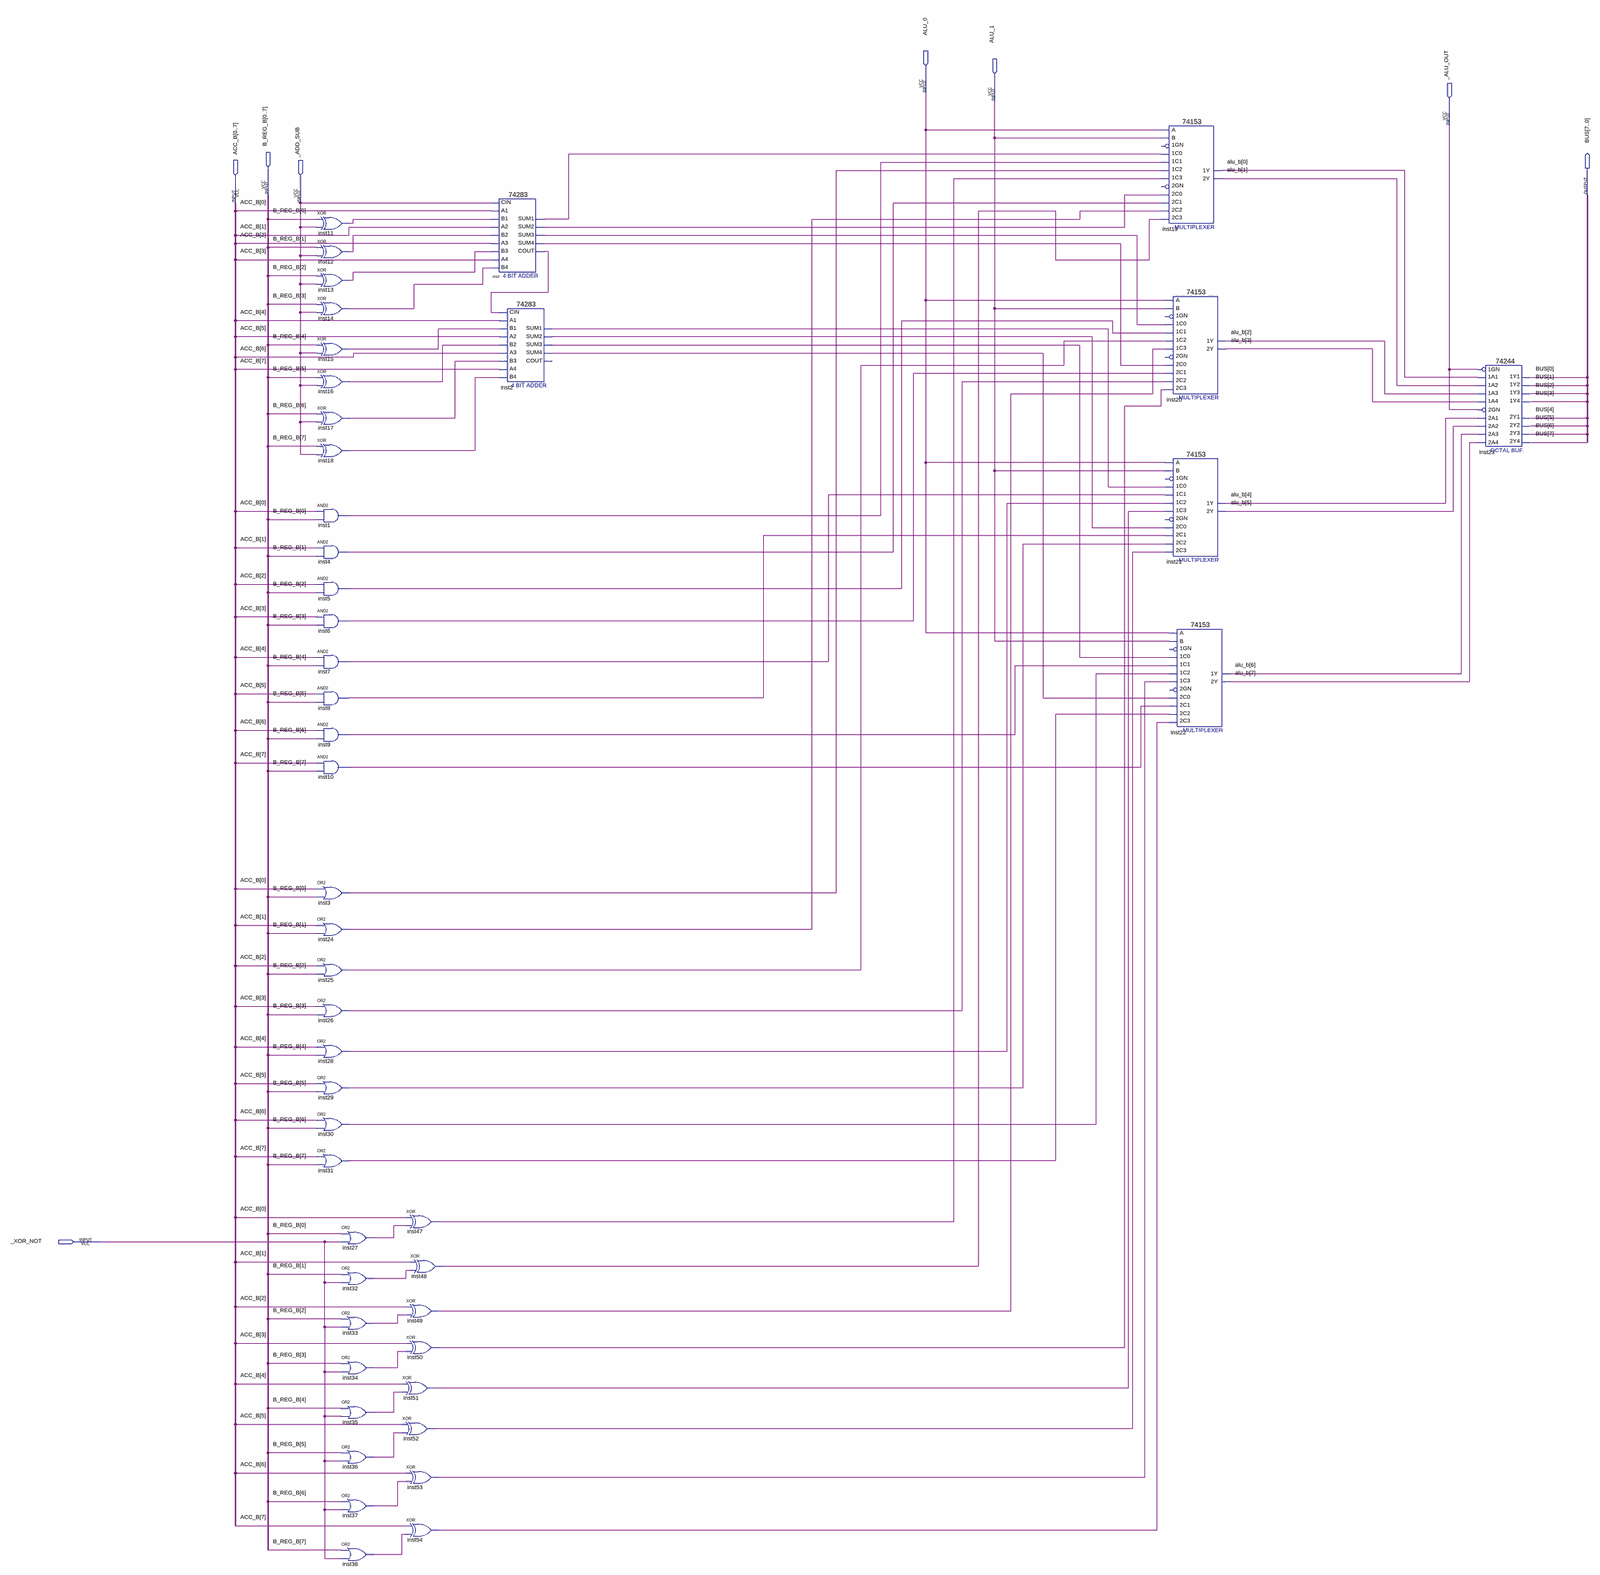
[diagram p0: schematic sheet, whole]
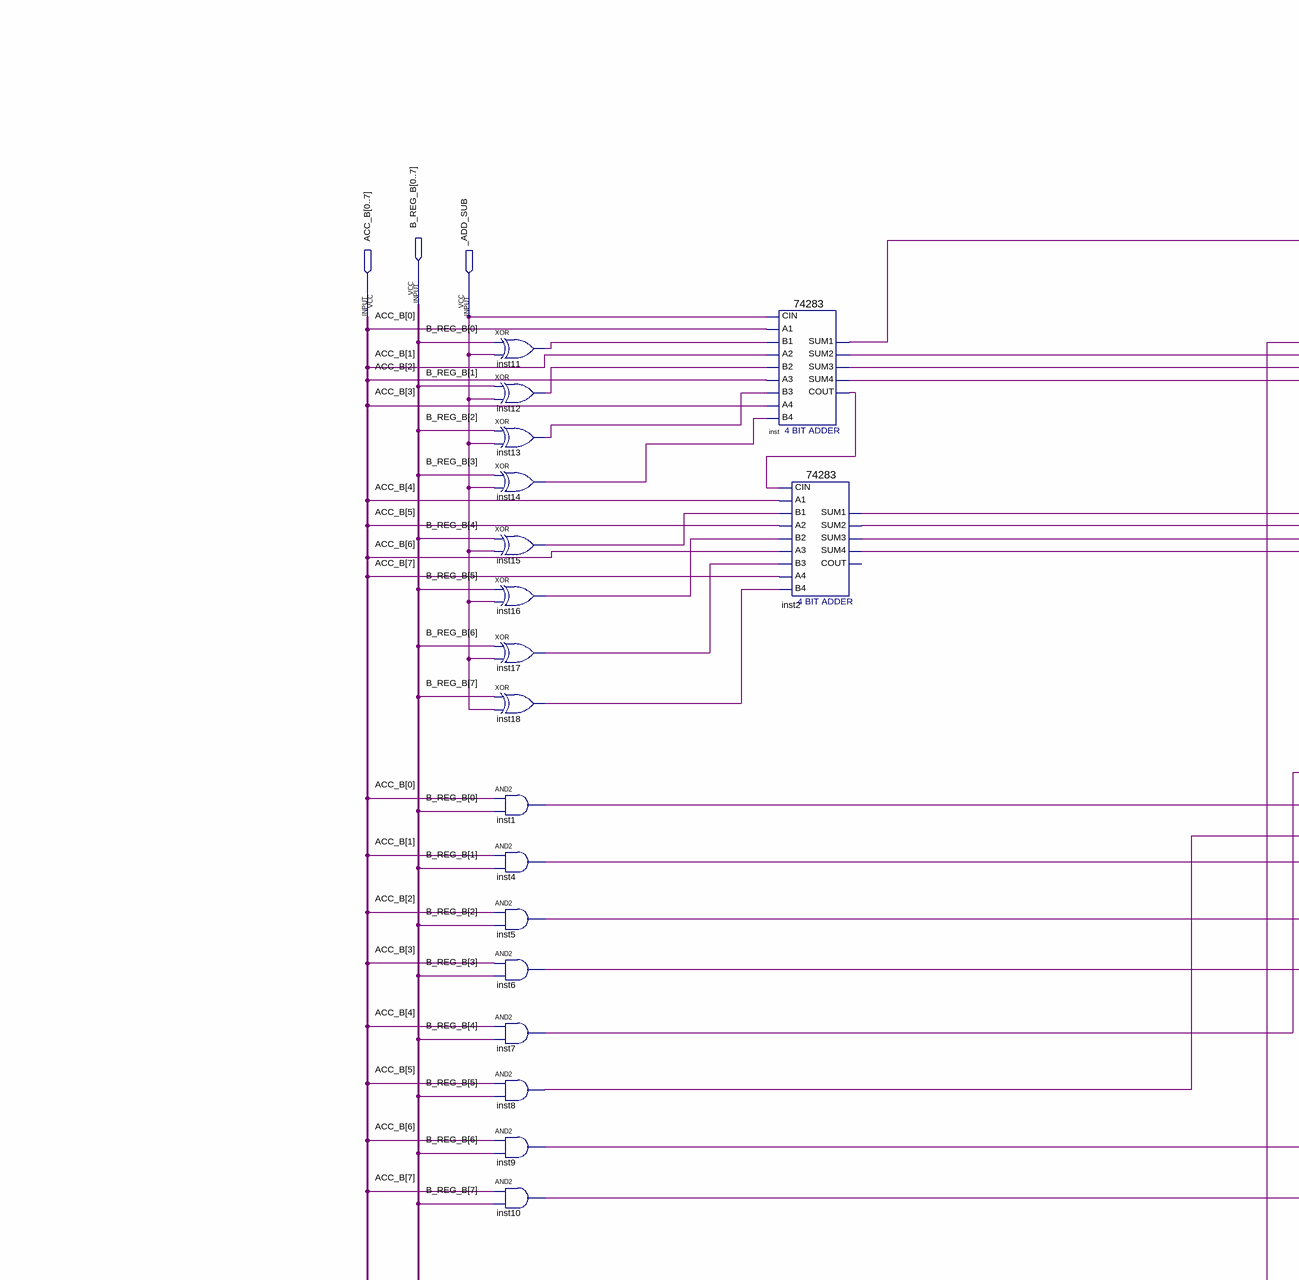
[diagram p1: schematic sheet, upper left part]
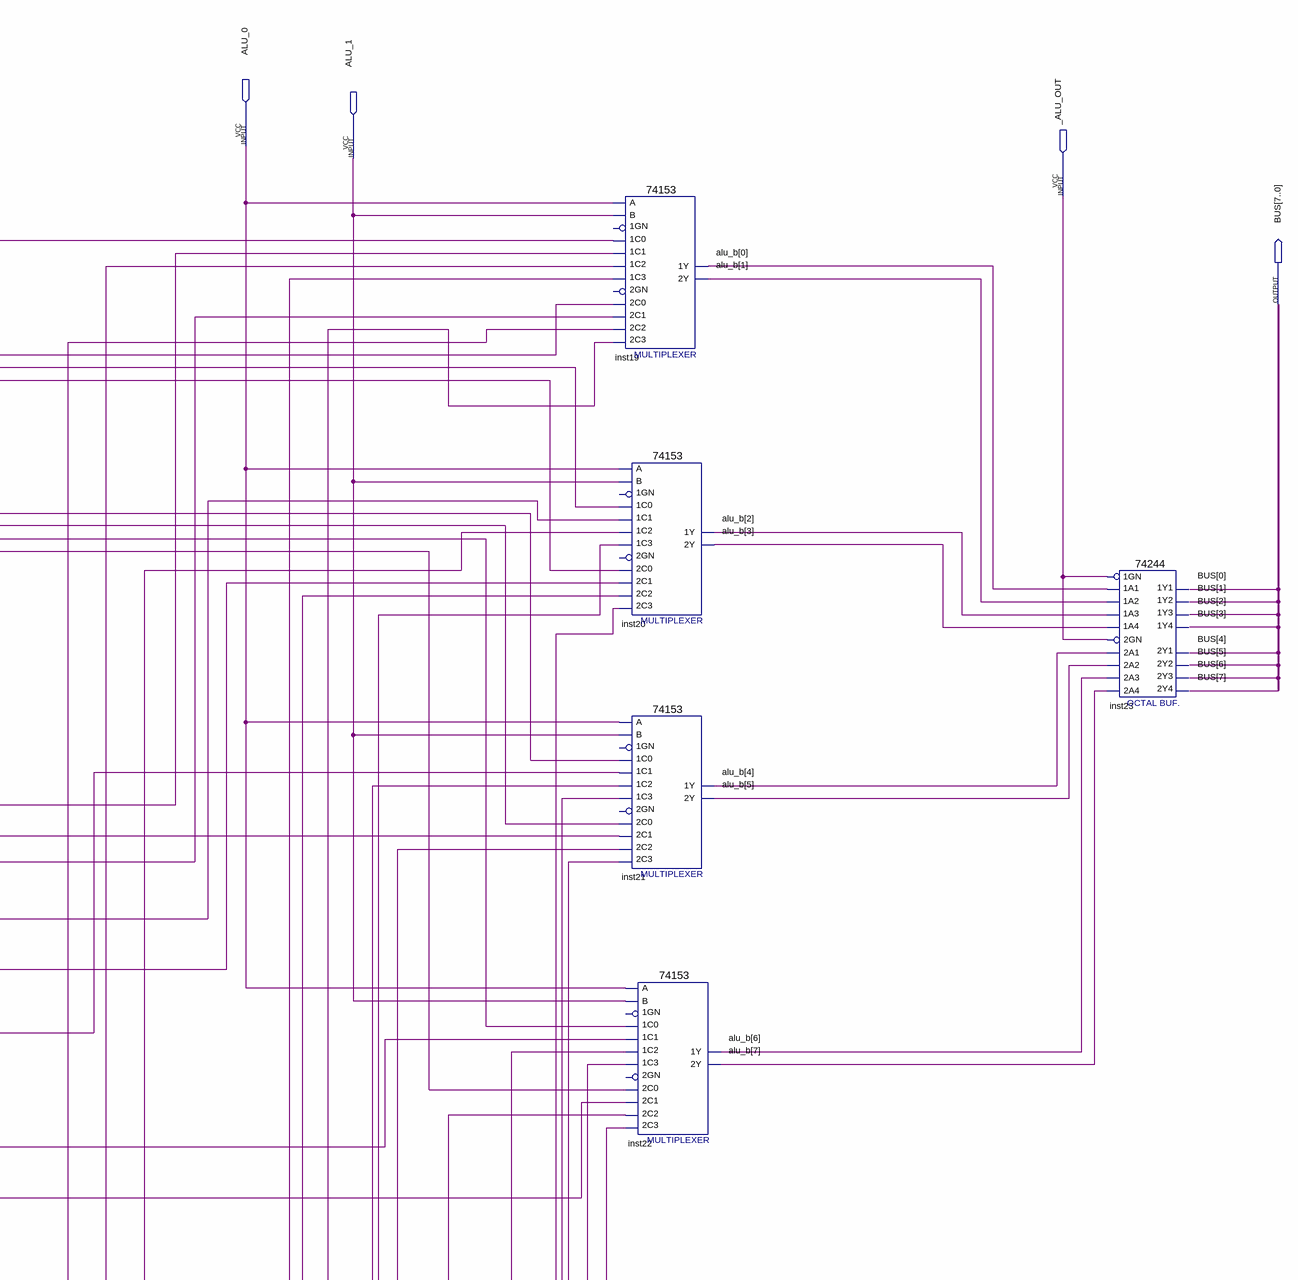
[diagram p2: schematic sheet, upper right part]
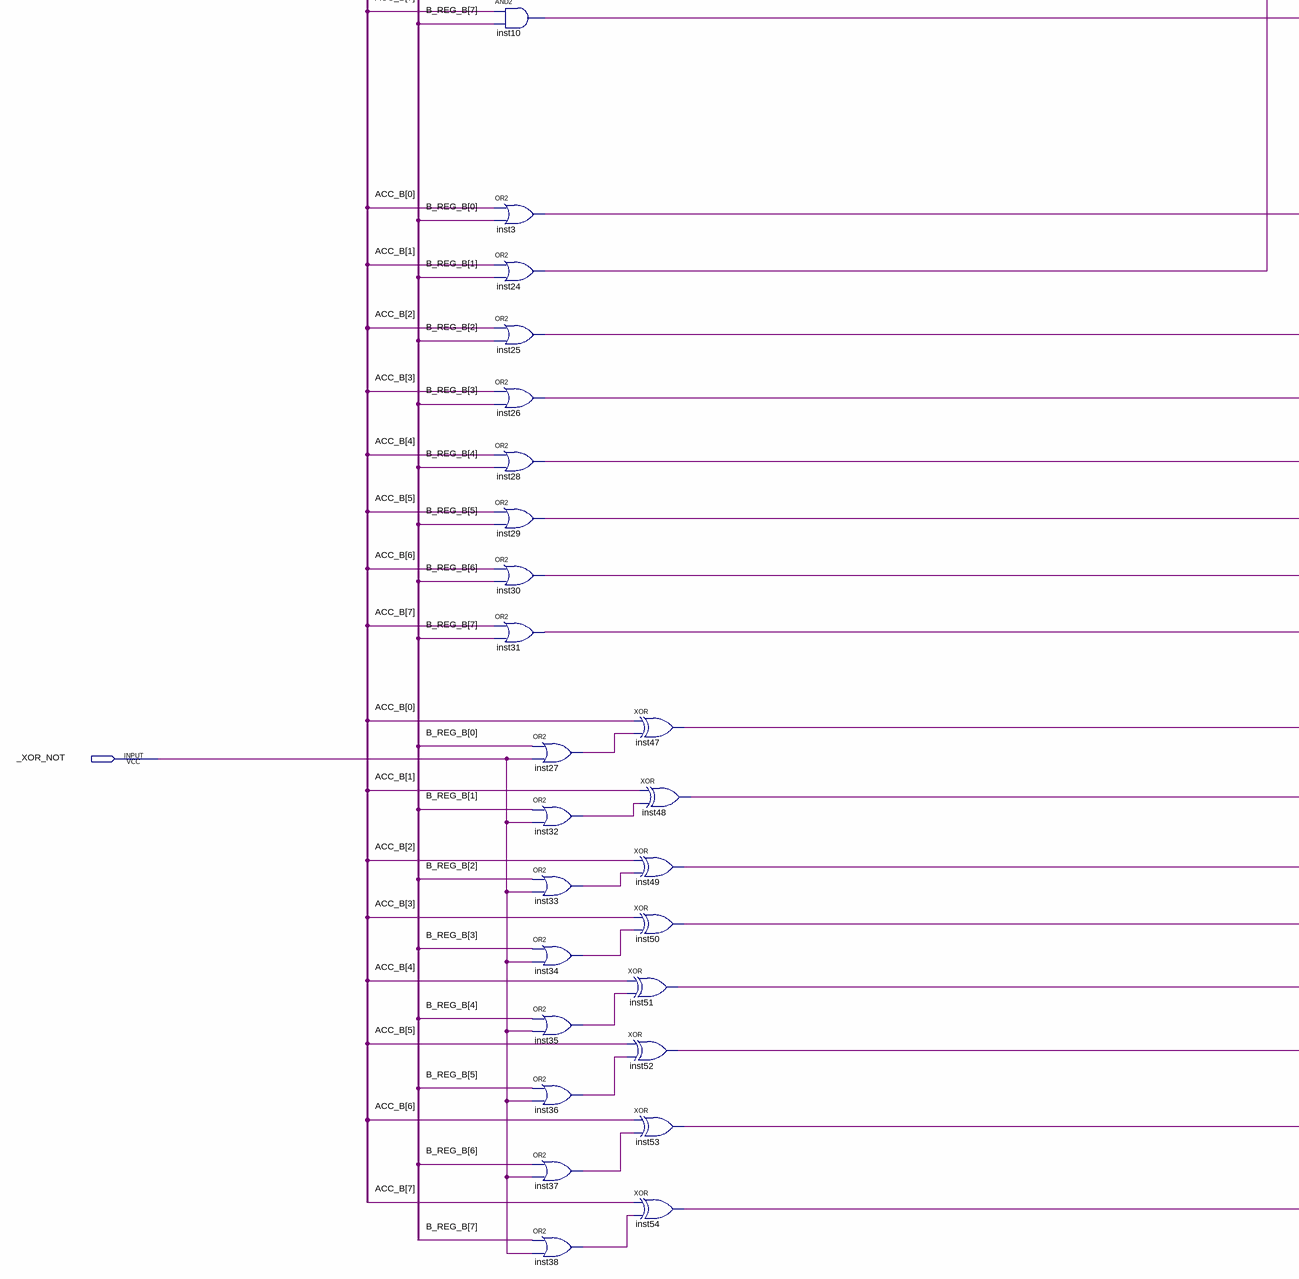
[diagram p3: schematic sheet, lower left part]
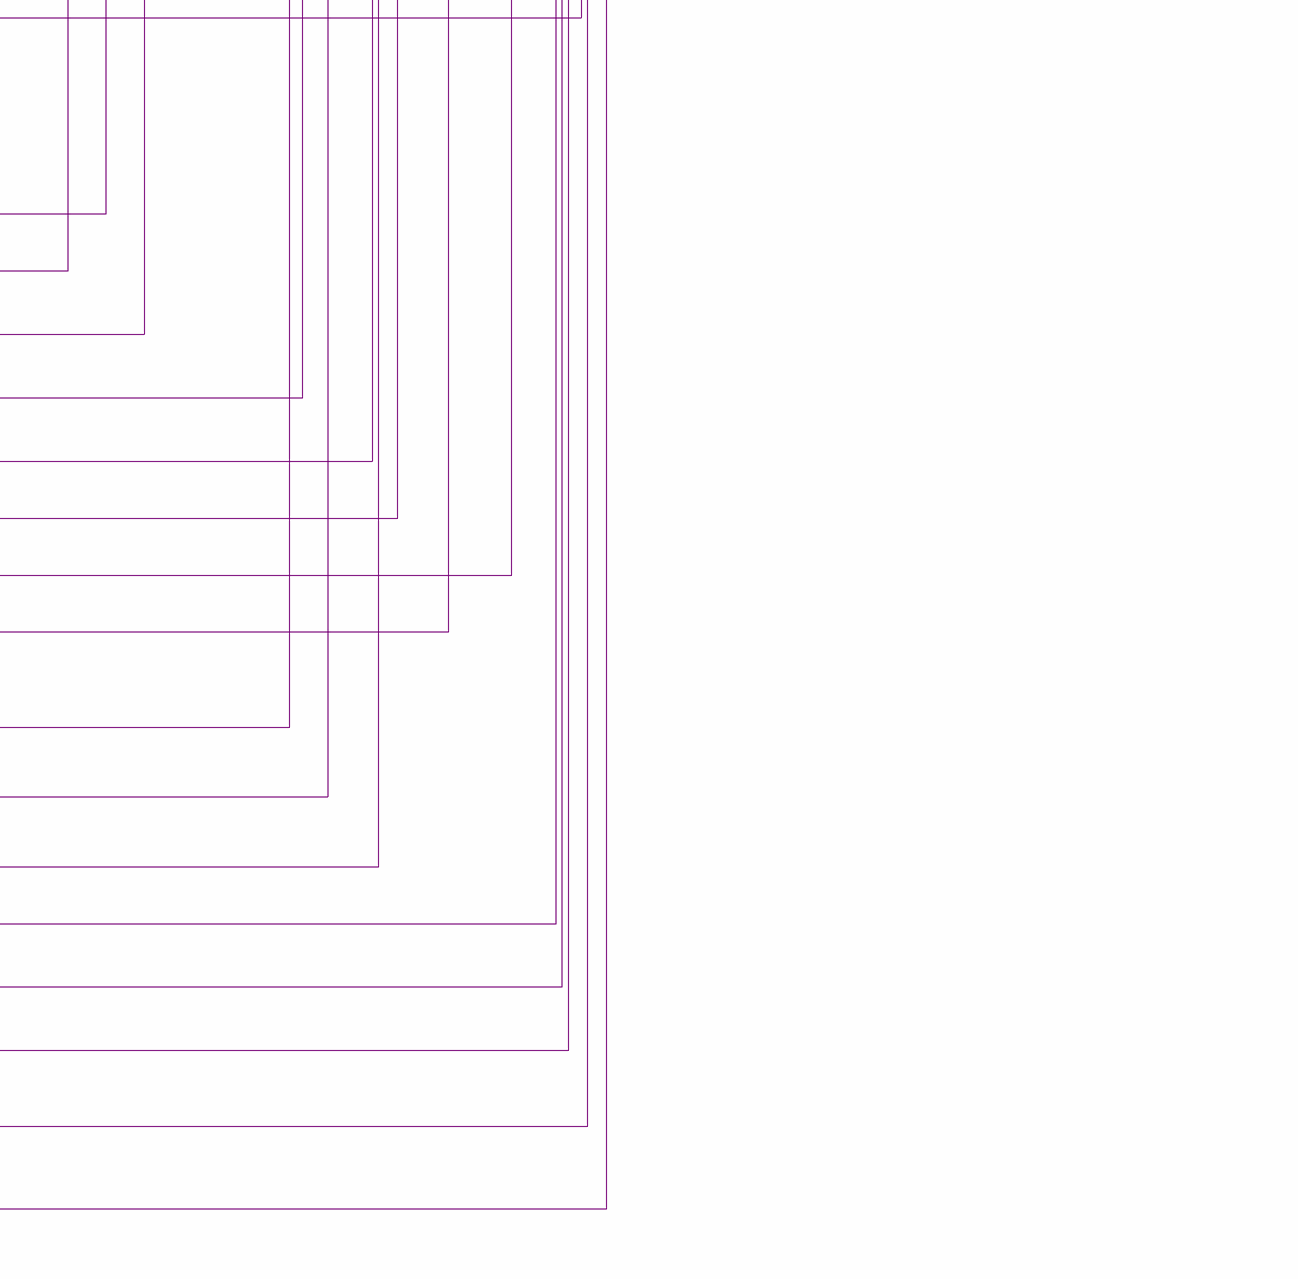
[diagram p4: schematic sheet, lower right part]
// Quartus schematic TrabalhoSistemas.bdf as structural Verilog: 47 symbols, 8 pins
module TrabalhoSistemas (
  input  ALU_0,
  input  ALU_1,
  input  _ALU_OUT,
  input  [0:7] B_REG_B,
  input  [0:7] ACC_B,
  input  _ADD_SUB,
  input  _XOR_NOT,
  output [7:0] BUS
);

  wire inst1_out, inst2_sum1, inst2_sum2, inst2_sum3, inst2_sum4, inst3_out, inst4_out, inst5_out, inst6_out,
       inst7_out, inst8_out, inst9_out, inst10_out, inst11_out, inst12_out, inst13_out, inst14_out,
       inst15_out, inst16_out, inst17_out, inst18_out, inst24_out, inst25_out, inst26_out, inst27_out,
       inst28_out, inst29_out, inst30_out, inst31_out, inst32_out, inst33_out, inst34_out, inst35_out,
       inst36_out, inst37_out, inst38_out, inst47_out, inst48_out, inst49_out, inst50_out, inst51_out,
       inst52_out, inst53_out, inst54_out, inst_cout, inst_sum1, inst_sum2, inst_sum3, inst_sum4;
  wire [7:0] alu_b;

  xor inst11 (inst11_out, B_REG_B[0], _ADD_SUB);
  xor inst12 (inst12_out, B_REG_B[1], _ADD_SUB);
  xor inst13 (inst13_out, B_REG_B[2], _ADD_SUB);
  xor inst14 (inst14_out, B_REG_B[3], _ADD_SUB);
  xor inst15 (inst15_out, B_REG_B[4], _ADD_SUB);
  xor inst16 (inst16_out, B_REG_B[5], _ADD_SUB);
  xor inst17 (inst17_out, B_REG_B[6], _ADD_SUB);
  xor inst18 (inst18_out, B_REG_B[7], _ADD_SUB);
  and inst1 (inst1_out, ACC_B[0], B_REG_B[0]);
  and inst4 (inst4_out, ACC_B[1], B_REG_B[1]);
  and inst5 (inst5_out, ACC_B[2], B_REG_B[2]);
  and inst6 (inst6_out, ACC_B[3], B_REG_B[3]);
  and inst7 (inst7_out, ACC_B[4], B_REG_B[4]);
  and inst8 (inst8_out, ACC_B[5], B_REG_B[5]);
  and inst9 (inst9_out, ACC_B[6], B_REG_B[6]);
  and inst10 (inst10_out, ACC_B[7], B_REG_B[7]);
  or inst3 (inst3_out, ACC_B[0], B_REG_B[0]);
  or inst24 (inst24_out, ACC_B[1], B_REG_B[1]);
  or inst25 (inst25_out, ACC_B[2], B_REG_B[2]);
  or inst26 (inst26_out, ACC_B[3], B_REG_B[3]);
  or inst28 (inst28_out, ACC_B[4], B_REG_B[4]);
  or inst29 (inst29_out, ACC_B[5], B_REG_B[5]);
  or inst30 (inst30_out, ACC_B[6], B_REG_B[6]);
  or inst31 (inst31_out, ACC_B[7], B_REG_B[7]);
  or inst27 (inst27_out, B_REG_B[0], _XOR_NOT);
  or inst32 (inst32_out, B_REG_B[1], _XOR_NOT);
  or inst33 (inst33_out, B_REG_B[2], _XOR_NOT);
  or inst34 (inst34_out, B_REG_B[3], _XOR_NOT);
  or inst35 (inst35_out, B_REG_B[4], _XOR_NOT);
  or inst36 (inst36_out, B_REG_B[5], _XOR_NOT);
  or inst37 (inst37_out, B_REG_B[6], _XOR_NOT);
  or inst38 (inst38_out, B_REG_B[7], _XOR_NOT);
  xor inst47 (inst47_out, ACC_B[0], inst27_out);
  xor inst48 (inst48_out, ACC_B[1], inst32_out);
  xor inst49 (inst49_out, ACC_B[2], inst33_out);
  xor inst50 (inst50_out, ACC_B[3], inst34_out);
  xor inst51 (inst51_out, ACC_B[4], inst35_out);
  xor inst52 (inst52_out, ACC_B[5], inst36_out);
  xor inst53 (inst53_out, ACC_B[6], inst37_out);
  xor inst54 (inst54_out, ACC_B[7], inst38_out);
  \74283  inst (
    .CIN(_ADD_SUB), .A1(ACC_B[0]), .A2(ACC_B[1]), .B2(inst12_out), .A3(ACC_B[2]), .A4(ACC_B[3]),
    .B4(inst14_out), .B1(inst11_out), .B3(inst13_out), .SUM4(inst_sum4), .COUT(inst_cout), .SUM1(inst_sum1),
    .SUM2(inst_sum2), .SUM3(inst_sum3));
  \74283  inst2 (
    .CIN(inst_cout), .A1(ACC_B[4]), .A2(ACC_B[5]), .B2(inst16_out), .A3(ACC_B[6]), .A4(ACC_B[7]),
    .B4(inst18_out), .B1(inst15_out), .B3(inst17_out), .SUM4(inst2_sum4), .SUM1(inst2_sum1),
    .SUM2(inst2_sum2), .SUM3(inst2_sum3));  // open: COUT
  \74153  inst19 (
    .\1C1 (inst1_out), .\1C0 (inst_sum1), .\2C0 (inst_sum2), .\2C2 (inst24_out), .\1C2 (inst3_out),
    .\1C3 (inst47_out), .B(ALU_1), .A(ALU_0), .\2C1 (inst4_out), .\2C3 (inst48_out), .\1Y (alu_b[0]),
    .\2Y (alu_b[1]));  // open: 1GN, 2GN
  \74153  inst20 (
    .\1C1 (inst5_out), .\1C0 (inst_sum3), .\2C0 (inst_sum4), .\2C2 (inst26_out), .\1C2 (inst25_out),
    .\1C3 (inst49_out), .B(ALU_1), .A(ALU_0), .\2C1 (inst6_out), .\2C3 (inst50_out), .\1Y (alu_b[2]),
    .\2Y (alu_b[3]));  // open: 1GN, 2GN
  \74153  inst21 (
    .\1C1 (inst7_out), .\1C0 (inst2_sum1), .\2C0 (inst2_sum2), .\2C2 (inst29_out), .\1C2 (inst28_out),
    .\1C3 (inst51_out), .B(ALU_1), .A(ALU_0), .\2C1 (inst8_out), .\2C3 (inst52_out), .\1Y (alu_b[4]),
    .\2Y (alu_b[5]));  // open: 1GN, 2GN
  \74153  inst22 (
    .\1C1 (inst9_out), .\1C0 (inst2_sum3), .\2C0 (inst2_sum4), .\2C2 (inst31_out), .\1C2 (inst30_out),
    .\1C3 (inst53_out), .B(ALU_1), .A(ALU_0), .\2C1 (inst10_out), .\2C3 (inst54_out), .\1Y (alu_b[6]),
    .\2Y (alu_b[7]));  // open: 1GN, 2GN
  \74244  inst23 (
    .\1A2 (alu_b[1]), .\1A4 (alu_b[3]), .\1A1 (alu_b[0]), .\1A3 (alu_b[2]), .\1GN (_ALU_OUT),
    .\2A3 (alu_b[6]), .\2GN (_ALU_OUT), .\2A1 (alu_b[4]), .\2A4 (alu_b[7]), .\2A2 (alu_b[5]), .\1Y2 (BUS[1]),
    .\1Y4 (BUS[3]), .\2Y1 (BUS[4]), .\1Y1 (BUS[0]), .\2Y3 (BUS[6]), .\2Y4 (BUS[7]), .\1Y3 (BUS[2]),
    .\2Y2 (BUS[5]));
endmodule
